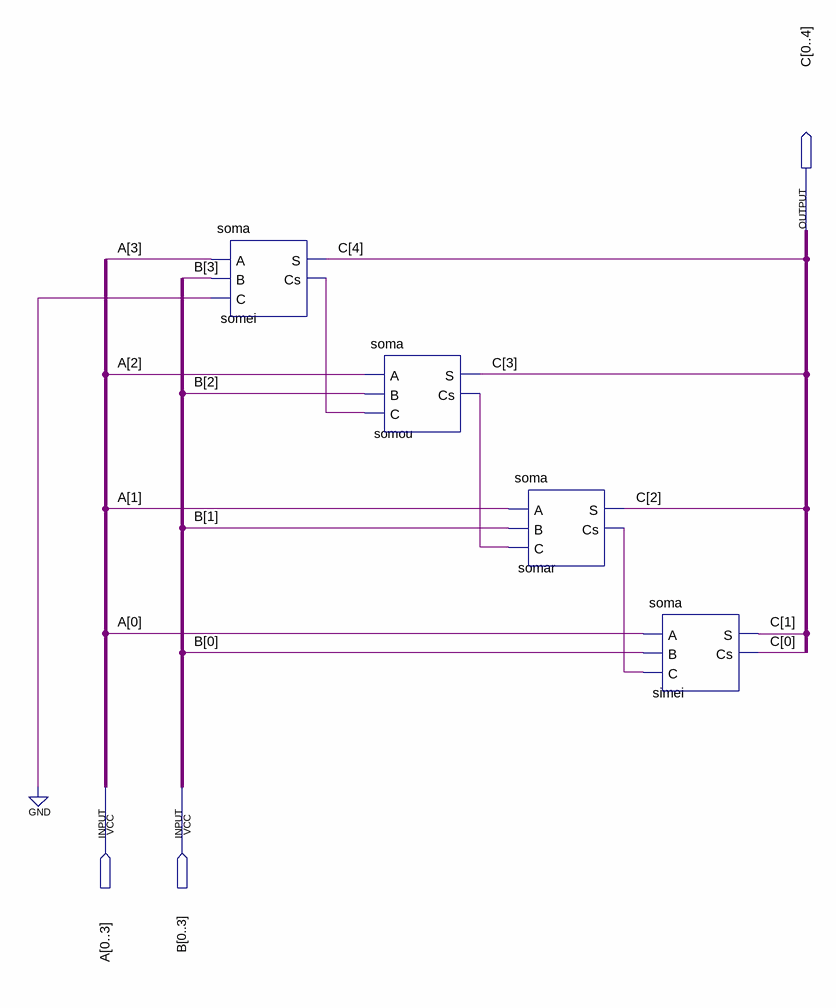
[diagram p0: schematic sheet]
// Quartus schematic somatorio.bdf as structural Verilog: 4 symbols, 3 pins
module somatorio (
  input  [0:3] A,
  input  [0:3] B,
  output [0:4] C
);

  wire somar_cs, somei_cs, somou_cs;

  soma somei (.A(A[3]), .B(B[3]), .C(1'b0), .S(C[4]), .Cs(somei_cs));
  soma somou (.A(A[2]), .B(B[2]), .C(somei_cs), .S(C[3]), .Cs(somou_cs));
  soma somar (.A(A[1]), .B(B[1]), .C(somou_cs), .S(C[2]), .Cs(somar_cs));
  soma simei (.A(A[0]), .B(B[0]), .C(somar_cs), .S(C[1]), .Cs(C[0]));
endmodule
